# Altium schematic sheet SD3078.SchDoc
size A4; SheetNumber: 13; SheetTotal: 17
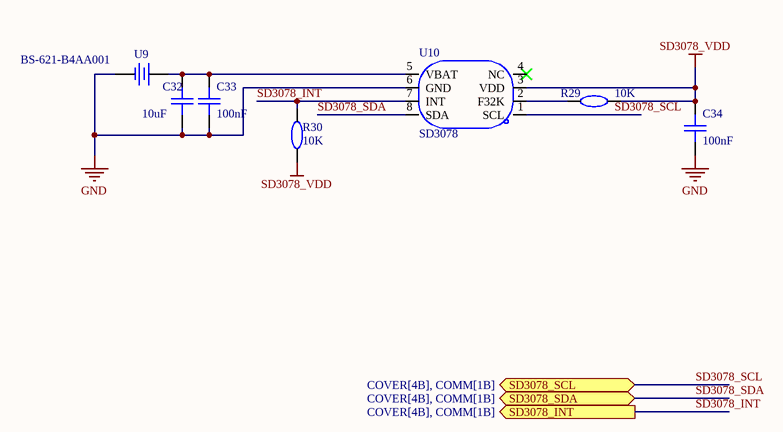
[diagram p0: SD3078.SchDoc]

## Parts
C32  10uF  [C0603]
C33  100nF  [C0402]
C34  100nF  [C0402]
R29  10K  [R0402]
R30  10K  [R0402]
U9  BS-621-B4AA001  [BAT-SMD_BS-621-B4AA001]
U10  SD3078  [SOP-8_L5.3-W5.2-P1.27-LS7.9-BL]

## Ports
SD3078_INT (out, see COVER[4B], COMM[1B]), SD3078_SCL (bidir, see COVER[4B], COMM[1B]), SD3078_SDA (bidir, see COVER[4B], COMM[1B])

## Nets
GND: C32.1 C33.1 C34.1 U9.1 U10.6(GND)
SD3078_VDD: C34.2 R29.2 R30.1 U10.3(VDD)
SD3078_INT: R30.2 U10.7(INT) ; port SD3078_INT
SD3078_SCL: U10.1(SCL) ; port SD3078_SCL
SD3078_SDA: U10.8(SDA) ; port SD3078_SDA
NetC32_2: C32.2 C33.2 U9.2 U10.5(VBAT)
NetR29_1: R29.1 U10.2(F32K)

Not connected (* = marked no-connect by the designer): U10 4(NC)*

## Library data of the parts
C32 = CAP_0603: Symbol: CapAcitance; Convert to PCB: yes; Device: CAP_0603; Add into BOM: yes; Supplier Footprint: 0603; Value: 10uF; Name: 10uF
C33 C34 = CAP_0402: Symbol: CapAcitance; Device: CAP_0603; Convert to PCB: yes; Add into BOM: yes; Supplier Footprint: 0603; Value: 100nF; Name: 100nF
R29 R30 = Res_0402: Symbol: 电阻; Device: Res_0603; Convert to PCB: yes; Add into BOM: yes; Supplier Footprint: 0603; Value: 10K; Name: 10K
U9 = BS-621-B4AA001: Manufacturer: MYOUNG(美阳); Add into BOM: yes; Connector Type: 电池底座; Battery Type: CR621; Symbol: BS-621-B4AA001; Device: BS-621-B4AA001; LCSC Part Name: 电池底座 适用电池:CR621; Supplier Part: C7525440; Manufacturer Part: BS-621-B4AA001; Supplier Footprint: SMD; Datasheet: https://atta.szlcsc.com/upload/public/pdf/source/20230821/914923C1DE837EC779C4976F7575F8B8.pdf; Supplier: LCSC; Convert to PCB: yes; Contact Material: 磷青铜; Contact Plating: 金; Operating Temperature Range: -25℃~+85℃; Name: BS-621-B4AA001
U10 = SD3078: Manufacturer: WAVE(兴威帆电子); Add into BOM: yes; Interface: I2C; Operating Voltage: 2.7V~5.5V; crystal oscillator: 内置; Symbol: SD3078; Device: SD3078; LCSC Part Name: SD3078; Supplier Part: C916255; Manufacturer Part: SD3078; Supplier Footprint: SOP-8-208mil; Datasheet: https://atta.szlcsc.com/upload/public/pdf/source/20220531/5E01E4A08D81DAED8B92A927505F3549.pdf; Supplier: LCSC; Convert to PCB: yes; Supply Current: -; The alarm clock output: -; Operating Temperature: -40℃~+85℃; Name: SD3078